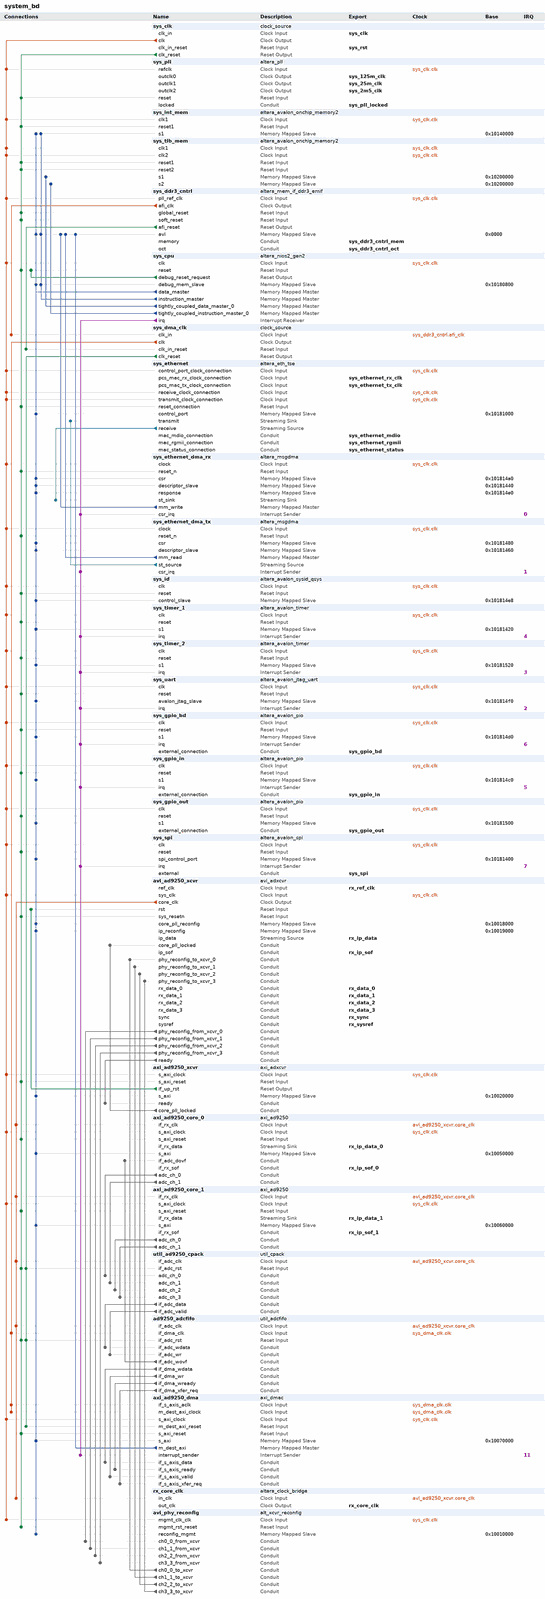
[diagram p0: system contents, whole]
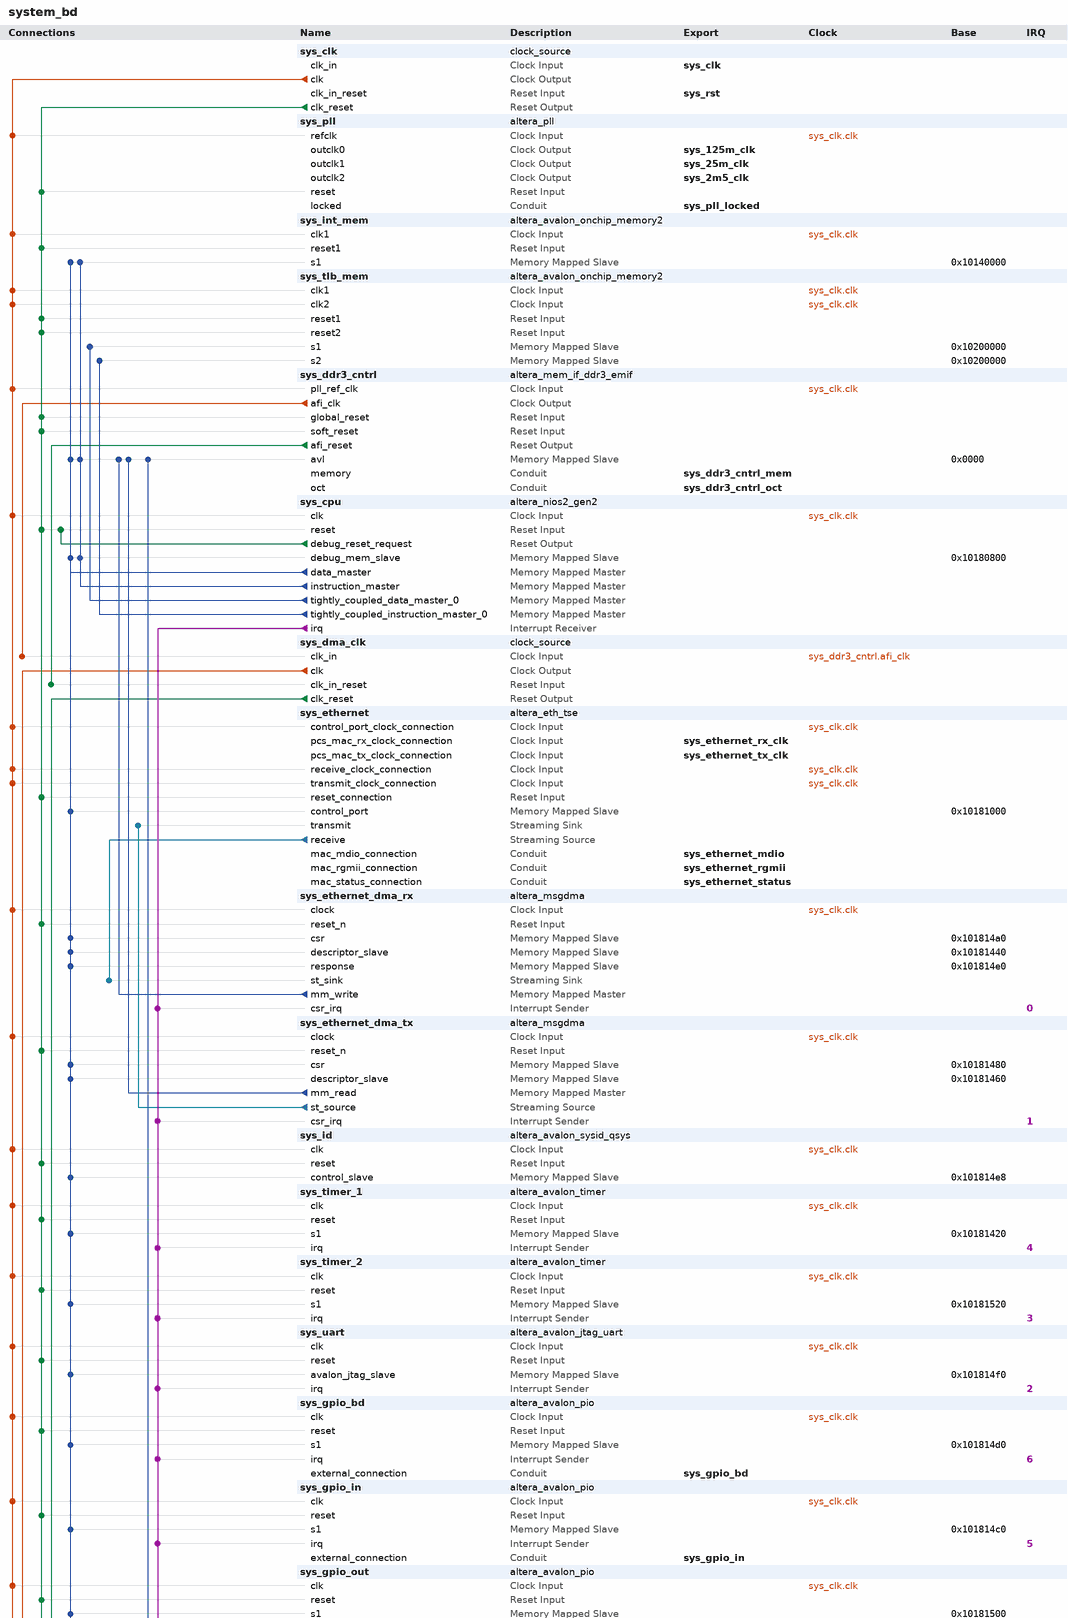
[diagram p1: system contents, upper part]
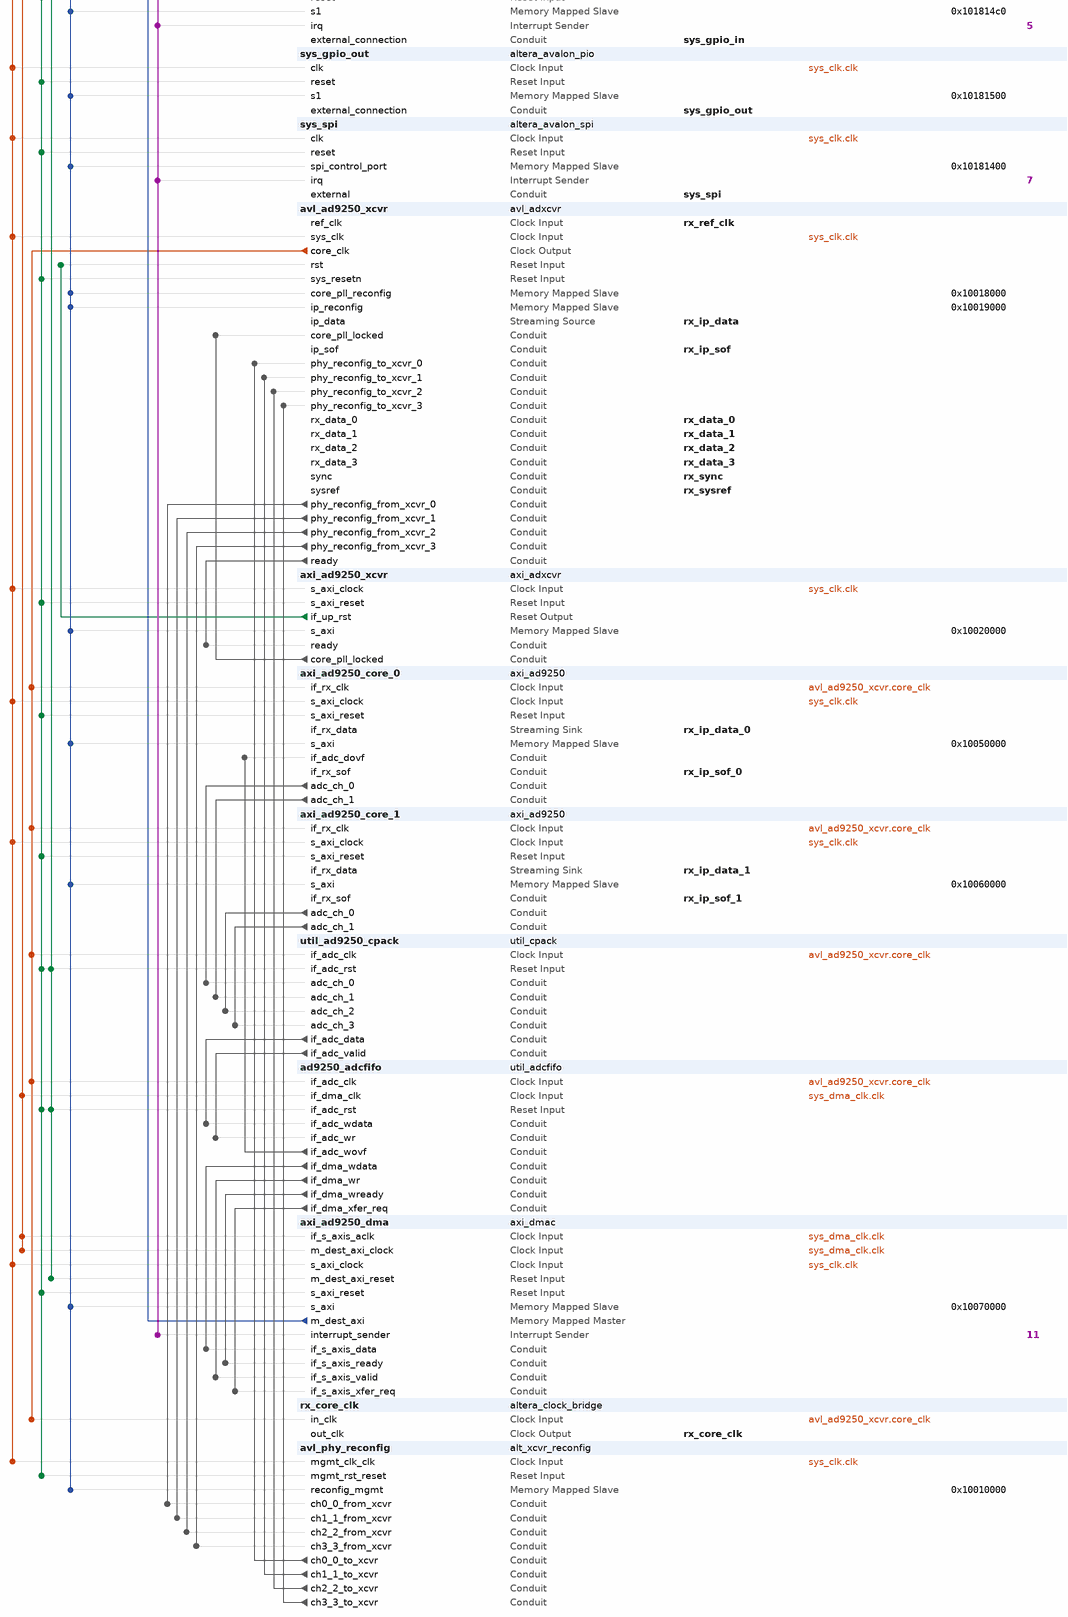
[diagram p2: system contents, lower part]
# Platform Designer (Qsys) system system_bd, Arria V 5AGTFD7K3F40I3
# Parameters at their usual value, and those the tool derives, are not listed.
package require -exact qsys 16.0
create_system system_bd
set_project_property DEVICE_FAMILY {Arria V}
set_project_property DEVICE 5AGTFD7K3F40I3

add_instance sys_clk clock_source 16.0
set_instance_parameter_value sys_clk clockFrequency 100000000
set_instance_parameter_value sys_clk resetSynchronousEdges DEASSERT

add_instance sys_pll altera_pll 16.0
set_instance_parameter_value sys_pll gui_device_speed_grade 1
set_instance_parameter_value sys_pll gui_number_of_clocks 3
set_instance_parameter_value sys_pll gui_operation_mode direct
set_instance_parameter_value sys_pll gui_output_clock_frequency0 125.0
set_instance_parameter_value sys_pll gui_output_clock_frequency1 25.0
set_instance_parameter_value sys_pll gui_output_clock_frequency2 2.5
set_instance_parameter_value sys_pll gui_pll_mode {Integer-N PLL}
set_instance_parameter_value sys_pll gui_reference_clock_frequency 100.0
set_instance_parameter_value sys_pll gui_use_locked true

add_instance sys_int_mem altera_avalon_onchip_memory2 16.0
set_instance_parameter_value sys_int_mem dataWidth 32
set_instance_parameter_value sys_int_mem dualPort false
set_instance_parameter_value sys_int_mem initMemContent false
set_instance_parameter_value sys_int_mem initializationFileName onchip_mem.hex
set_instance_parameter_value sys_int_mem memorySize 163840

add_instance sys_tlb_mem altera_avalon_onchip_memory2 16.0
set_instance_parameter_value sys_tlb_mem dataWidth 32
set_instance_parameter_value sys_tlb_mem dualPort true
set_instance_parameter_value sys_tlb_mem initMemContent true
set_instance_parameter_value sys_tlb_mem initializationFileName onchip_mem.hex
set_instance_parameter_value sys_tlb_mem memorySize 163840

add_instance sys_ddr3_cntrl altera_mem_if_ddr3_emif 16.0
set_instance_parameter_value sys_ddr3_cntrl AVL_MAX_SIZE 256
set_instance_parameter_value sys_ddr3_cntrl CALIBRATION_MODE Skip
set_instance_parameter_value sys_ddr3_cntrl CPORT_TYPE_PORT Bidirectional,Bidirectional,Bidirectional,Bidirectional,Bidirectional,Bidirectional
set_instance_parameter_value sys_ddr3_cntrl EXPORT_AFI_HALF_CLK false
set_instance_parameter_value sys_ddr3_cntrl HARD_EMIF false
set_instance_parameter_value sys_ddr3_cntrl MEM_BANKADDR_WIDTH 3
set_instance_parameter_value sys_ddr3_cntrl MEM_CLK_FREQ 400.0
set_instance_parameter_value sys_ddr3_cntrl MEM_CLK_FREQ_MAX 666.667
set_instance_parameter_value sys_ddr3_cntrl MEM_COL_ADDR_WIDTH 10
set_instance_parameter_value sys_ddr3_cntrl MEM_DQ_WIDTH 64
set_instance_parameter_value sys_ddr3_cntrl MEM_DRV_STR RZQ/6
set_instance_parameter_value sys_ddr3_cntrl MEM_FORMAT DISCRETE
set_instance_parameter_value sys_ddr3_cntrl MEM_ROW_ADDR_WIDTH 12
set_instance_parameter_value sys_ddr3_cntrl MEM_TCL 11
set_instance_parameter_value sys_ddr3_cntrl MEM_TFAW_NS 30.0
set_instance_parameter_value sys_ddr3_cntrl MEM_TRAS_NS 35.0
set_instance_parameter_value sys_ddr3_cntrl MEM_TRCD_NS 13.75
set_instance_parameter_value sys_ddr3_cntrl MEM_TRFC_NS 110.0
set_instance_parameter_value sys_ddr3_cntrl MEM_TRP_NS 13.75
set_instance_parameter_value sys_ddr3_cntrl MEM_TRRD_NS 6.0
set_instance_parameter_value sys_ddr3_cntrl MEM_TRTP_NS 7.5
set_instance_parameter_value sys_ddr3_cntrl MEM_TWTR 6
set_instance_parameter_value sys_ddr3_cntrl MEM_VENDOR Micron
set_instance_parameter_value sys_ddr3_cntrl MEM_WTCL 8
set_instance_parameter_value sys_ddr3_cntrl PLL_LOCATION Top_Bottom
set_instance_parameter_value sys_ddr3_cntrl POWER_OF_TWO_BUS false
set_instance_parameter_value sys_ddr3_cntrl PRIORITY_PORT 1,1,1,1,1,1
set_instance_parameter_value sys_ddr3_cntrl RATE Quarter
set_instance_parameter_value sys_ddr3_cntrl REF_CLK_FREQ 100.0
set_instance_parameter_value sys_ddr3_cntrl SPEED_GRADE 3
set_instance_parameter_value sys_ddr3_cntrl TIMING_BOARD_AC_SKEW 0.02
set_instance_parameter_value sys_ddr3_cntrl TIMING_BOARD_AC_TO_CK_SKEW 0.0
set_instance_parameter_value sys_ddr3_cntrl TIMING_BOARD_DQ_TO_DQS_SKEW 0.0
set_instance_parameter_value sys_ddr3_cntrl TIMING_BOARD_MAX_CK_DELAY 0.6
set_instance_parameter_value sys_ddr3_cntrl TIMING_BOARD_MAX_DQS_DELAY 0.6
set_instance_parameter_value sys_ddr3_cntrl TIMING_BOARD_SKEW_BETWEEN_DQS 0.02
set_instance_parameter_value sys_ddr3_cntrl TIMING_BOARD_SKEW_CKDQS_DIMM_MAX 0.01
set_instance_parameter_value sys_ddr3_cntrl TIMING_BOARD_SKEW_CKDQS_DIMM_MIN -0.01
set_instance_parameter_value sys_ddr3_cntrl TIMING_BOARD_SKEW_WITHIN_DQS 0.02
set_instance_parameter_value sys_ddr3_cntrl TIMING_TDH 45
set_instance_parameter_value sys_ddr3_cntrl TIMING_TDQSCK 255
set_instance_parameter_value sys_ddr3_cntrl TIMING_TDQSQ 100
set_instance_parameter_value sys_ddr3_cntrl TIMING_TDQSS 0.27
set_instance_parameter_value sys_ddr3_cntrl TIMING_TDS 10
set_instance_parameter_value sys_ddr3_cntrl TIMING_TDSH 0.18
set_instance_parameter_value sys_ddr3_cntrl TIMING_TDSS 0.18
set_instance_parameter_value sys_ddr3_cntrl TIMING_TIH 120
set_instance_parameter_value sys_ddr3_cntrl TIMING_TIS 170
set_instance_parameter_value sys_ddr3_cntrl TIMING_TQSH 0.4
set_instance_parameter_value sys_ddr3_cntrl USER_DEBUG_LEVEL 1

add_instance sys_cpu altera_nios2_gen2 16.0
set_instance_parameter_value sys_cpu dcache_numTCDM 1
set_instance_parameter_value sys_cpu dcache_size 32768
set_instance_parameter_value sys_cpu exceptionSlave sys_ddr3_cntrl.avl
set_instance_parameter_value sys_cpu icache_numTCIM 1
set_instance_parameter_value sys_cpu icache_size 32768
set_instance_parameter_value sys_cpu impl Fast
set_instance_parameter_value sys_cpu mmu_TLBMissExcOffset 4096
set_instance_parameter_value sys_cpu mmu_TLBMissExcSlave sys_tlb_mem.s2
set_instance_parameter_value sys_cpu mmu_autoAssignTlbPtrSz false
set_instance_parameter_value sys_cpu mmu_enabled true
set_instance_parameter_value sys_cpu mul_32_impl 3
set_instance_parameter_value sys_cpu resetSlave sys_ddr3_cntrl.avl
set_instance_parameter_value sys_cpu setting_activateTrace true
set_instance_parameter_value sys_cpu setting_support31bitdcachebypass false
set_instance_parameter_value sys_cpu shift_rot_impl 0

add_instance sys_dma_clk clock_source 16.0
set_instance_parameter_value sys_dma_clk clockFrequency 50000000

add_instance sys_ethernet altera_eth_tse 16.0
set_instance_parameter_value sys_ethernet core_variation MAC_ONLY
set_instance_parameter_value sys_ethernet enable_hd_logic true
set_instance_parameter_value sys_ethernet enable_mac_flow_ctrl true
set_instance_parameter_value sys_ethernet enable_magic_detect true
set_instance_parameter_value sys_ethernet enable_shift16 true
set_instance_parameter_value sys_ethernet ifGMII RGMII
set_instance_parameter_value sys_ethernet ing_addr 11
set_instance_parameter_value sys_ethernet mdio_clk_div 30
set_instance_parameter_value sys_ethernet stat_cnt_ena true
set_instance_parameter_value sys_ethernet transceiver_type NONE

add_instance sys_ethernet_dma_rx altera_msgdma 16.0
set_instance_parameter_value sys_ethernet_dma_rx BURST_ENABLE 1
set_instance_parameter_value sys_ethernet_dma_rx DATA_FIFO_DEPTH 256
set_instance_parameter_value sys_ethernet_dma_rx DATA_WIDTH 64
set_instance_parameter_value sys_ethernet_dma_rx DESCRIPTOR_FIFO_DEPTH 512
set_instance_parameter_value sys_ethernet_dma_rx ENHANCED_FEATURES 1
set_instance_parameter_value sys_ethernet_dma_rx ERROR_ENABLE 1
set_instance_parameter_value sys_ethernet_dma_rx ERROR_WIDTH 6
set_instance_parameter_value sys_ethernet_dma_rx MAX_BURST_COUNT 64
set_instance_parameter_value sys_ethernet_dma_rx MAX_BYTE 2048
set_instance_parameter_value sys_ethernet_dma_rx MODE 2
set_instance_parameter_value sys_ethernet_dma_rx PACKET_ENABLE 1
set_instance_parameter_value sys_ethernet_dma_rx RESPONSE_PORT 0
set_instance_parameter_value sys_ethernet_dma_rx TRANSFER_TYPE {Unaligned Accesses}

add_instance sys_ethernet_dma_tx altera_msgdma 16.0
set_instance_parameter_value sys_ethernet_dma_tx BURST_ENABLE 1
set_instance_parameter_value sys_ethernet_dma_tx DATA_FIFO_DEPTH 256
set_instance_parameter_value sys_ethernet_dma_tx DATA_WIDTH 64
set_instance_parameter_value sys_ethernet_dma_tx DESCRIPTOR_FIFO_DEPTH 512
set_instance_parameter_value sys_ethernet_dma_tx ENHANCED_FEATURES 1
set_instance_parameter_value sys_ethernet_dma_tx ERROR_ENABLE 1
set_instance_parameter_value sys_ethernet_dma_tx ERROR_WIDTH 1
set_instance_parameter_value sys_ethernet_dma_tx MAX_BURST_COUNT 64
set_instance_parameter_value sys_ethernet_dma_tx MAX_BYTE 2048
set_instance_parameter_value sys_ethernet_dma_tx MODE 1
set_instance_parameter_value sys_ethernet_dma_tx PACKET_ENABLE 1
set_instance_parameter_value sys_ethernet_dma_tx TRANSFER_TYPE {Unaligned Accesses}

add_instance sys_id altera_avalon_sysid_qsys 16.0
set_instance_parameter_value sys_id id 182193580

add_instance sys_timer_1 altera_avalon_timer 16.0
set_instance_parameter_value sys_timer_1 period 1
set_instance_parameter_value sys_timer_1 periodUnits MSEC

add_instance sys_timer_2 altera_avalon_timer 16.0
set_instance_parameter_value sys_timer_2 period 1
set_instance_parameter_value sys_timer_2 periodUnits MSEC

add_instance sys_uart altera_avalon_jtag_uart 16.0
set_instance_parameter_value sys_uart simInteractiveOptions NO_INTERACTIVE_WINDOWS

add_instance sys_gpio_bd altera_avalon_pio 16.0
set_instance_parameter_value sys_gpio_bd direction InOut
set_instance_parameter_value sys_gpio_bd generateIRQ true
set_instance_parameter_value sys_gpio_bd width 32

add_instance sys_gpio_in altera_avalon_pio 16.0
set_instance_parameter_value sys_gpio_in direction Input
set_instance_parameter_value sys_gpio_in generateIRQ true
set_instance_parameter_value sys_gpio_in width 32

add_instance sys_gpio_out altera_avalon_pio 16.0
set_instance_parameter_value sys_gpio_out direction Output
set_instance_parameter_value sys_gpio_out width 32

add_instance sys_spi altera_avalon_spi 16.0
set_instance_parameter_value sys_spi clockPolarity 0
set_instance_parameter_value sys_spi dataWidth 8
set_instance_parameter_value sys_spi masterSPI true
set_instance_parameter_value sys_spi numberOfSlaves 8
set_instance_parameter_value sys_spi targetClockRate 128000

add_instance avl_ad9250_xcvr avl_adxcvr 1.0
set_instance_parameter_value avl_ad9250_xcvr CORECLK_FREQUENCY 125.0
set_instance_parameter_value avl_ad9250_xcvr FRM_BCNT 4
set_instance_parameter_value avl_ad9250_xcvr FRM_SCNT 1
set_instance_parameter_value avl_ad9250_xcvr HD 0
set_instance_parameter_value avl_ad9250_xcvr ID 1
set_instance_parameter_value avl_ad9250_xcvr LANE_RATE 5000.0
set_instance_parameter_value avl_ad9250_xcvr MF_FCNT 32
set_instance_parameter_value avl_ad9250_xcvr NUM_OF_CONVS 4
set_instance_parameter_value avl_ad9250_xcvr NUM_OF_LANES 4
set_instance_parameter_value avl_ad9250_xcvr PCS_CONFIG JESD_PCS_CFG1
set_instance_parameter_value avl_ad9250_xcvr PLLCLK_FREQUENCY 2500.0
set_instance_parameter_value avl_ad9250_xcvr REFCLK_FREQUENCY 250.0
set_instance_parameter_value avl_ad9250_xcvr SYSCLK_FREQUENCY 100.0
set_instance_parameter_value avl_ad9250_xcvr TX_OR_RX_N 0

add_instance axi_ad9250_xcvr axi_adxcvr 1.0
set_instance_parameter_value axi_ad9250_xcvr ID 1
set_instance_parameter_value axi_ad9250_xcvr NUM_OF_LANES 4
set_instance_parameter_value axi_ad9250_xcvr TX_OR_RX_N 0

add_instance axi_ad9250_core_0 axi_ad9250 1.0
set_instance_parameter_value axi_ad9250_core_0 DEVICE_TYPE 1
set_instance_parameter_value axi_ad9250_core_0 ID 0

add_instance axi_ad9250_core_1 axi_ad9250 1.0
set_instance_parameter_value axi_ad9250_core_1 DEVICE_TYPE 1
set_instance_parameter_value axi_ad9250_core_1 ID 0

add_instance util_ad9250_cpack util_cpack 1.0
set_instance_parameter_value util_ad9250_cpack CHANNEL_DATA_WIDTH 32
set_instance_parameter_value util_ad9250_cpack NUM_OF_CHANNELS 4

add_instance ad9250_adcfifo util_adcfifo 1.0
set_instance_parameter_value ad9250_adcfifo ADC_DATA_WIDTH 128
set_instance_parameter_value ad9250_adcfifo DMA_ADDRESS_WIDTH 16
set_instance_parameter_value ad9250_adcfifo DMA_DATA_WIDTH 128
set_instance_parameter_value ad9250_adcfifo DMA_READY_ENABLE 1

add_instance axi_ad9250_dma axi_dmac 1.0
set_instance_parameter_value axi_ad9250_dma ASYNC_CLK_DEST_REQ 1
set_instance_parameter_value axi_ad9250_dma ASYNC_CLK_REQ_SRC 1
set_instance_parameter_value axi_ad9250_dma ASYNC_CLK_SRC_DEST 1
set_instance_parameter_value axi_ad9250_dma AXI_SLICE_DEST 0
set_instance_parameter_value axi_ad9250_dma AXI_SLICE_SRC 0
set_instance_parameter_value axi_ad9250_dma CYCLIC 0
set_instance_parameter_value axi_ad9250_dma DMA_2D_TRANSFER 0
set_instance_parameter_value axi_ad9250_dma DMA_DATA_WIDTH_DEST 128
set_instance_parameter_value axi_ad9250_dma DMA_DATA_WIDTH_SRC 128
set_instance_parameter_value axi_ad9250_dma DMA_LENGTH_WIDTH 24
set_instance_parameter_value axi_ad9250_dma DMA_TYPE_DEST 0
set_instance_parameter_value axi_ad9250_dma DMA_TYPE_SRC 1
set_instance_parameter_value axi_ad9250_dma FIFO_SIZE 4
set_instance_parameter_value axi_ad9250_dma ID 0
set_instance_parameter_value axi_ad9250_dma SYNC_TRANSFER_START 1

add_instance rx_core_clk altera_clock_bridge 16.0
set_instance_parameter_value rx_core_clk DERIVED_CLOCK_RATE 125
set_instance_parameter_value rx_core_clk EXPLICIT_CLOCK_RATE 0

add_instance avl_phy_reconfig alt_xcvr_reconfig 16.0
set_instance_parameter_value avl_phy_reconfig device_family {Arria V}
set_instance_parameter_value avl_phy_reconfig enable_adce 0
set_instance_parameter_value avl_phy_reconfig enable_analog 1
set_instance_parameter_value avl_phy_reconfig gui_split_sizes 1,1,1,1
set_instance_parameter_value avl_phy_reconfig number_of_reconfig_interfaces 4

# connections
add_connection avl_ad9250_xcvr.core_clk ad9250_adcfifo.if_adc_clk clock
add_connection avl_ad9250_xcvr.core_clk axi_ad9250_core_0.if_rx_clk clock
add_connection avl_ad9250_xcvr.core_clk axi_ad9250_core_1.if_rx_clk clock
add_connection avl_ad9250_xcvr.core_clk rx_core_clk.in_clk clock
add_connection avl_ad9250_xcvr.core_clk util_ad9250_cpack.if_adc_clk clock
add_connection sys_clk.clk avl_ad9250_xcvr.sys_clk clock
add_connection sys_clk.clk avl_phy_reconfig.mgmt_clk_clk clock
add_connection sys_clk.clk axi_ad9250_core_0.s_axi_clock clock
add_connection sys_clk.clk axi_ad9250_core_1.s_axi_clock clock
add_connection sys_clk.clk axi_ad9250_dma.s_axi_clock clock
add_connection sys_clk.clk axi_ad9250_xcvr.s_axi_clock clock
add_connection sys_clk.clk sys_cpu.clk clock
add_connection sys_clk.clk sys_ddr3_cntrl.pll_ref_clk clock
add_connection sys_clk.clk sys_ethernet.control_port_clock_connection clock
add_connection sys_clk.clk sys_ethernet.receive_clock_connection clock
add_connection sys_clk.clk sys_ethernet.transmit_clock_connection clock
add_connection sys_clk.clk sys_ethernet_dma_rx.clock clock
add_connection sys_clk.clk sys_ethernet_dma_tx.clock clock
add_connection sys_clk.clk sys_gpio_bd.clk clock
add_connection sys_clk.clk sys_gpio_in.clk clock
add_connection sys_clk.clk sys_gpio_out.clk clock
add_connection sys_clk.clk sys_id.clk clock
add_connection sys_clk.clk sys_int_mem.clk1 clock
add_connection sys_clk.clk sys_pll.refclk clock
add_connection sys_clk.clk sys_spi.clk clock
add_connection sys_clk.clk sys_timer_1.clk clock
add_connection sys_clk.clk sys_timer_2.clk clock
add_connection sys_clk.clk sys_tlb_mem.clk1 clock
add_connection sys_clk.clk sys_tlb_mem.clk2 clock
add_connection sys_clk.clk sys_uart.clk clock
add_connection sys_ddr3_cntrl.afi_clk sys_dma_clk.clk_in clock
add_connection sys_dma_clk.clk ad9250_adcfifo.if_dma_clk clock
add_connection sys_dma_clk.clk axi_ad9250_dma.if_s_axis_aclk clock
add_connection sys_dma_clk.clk axi_ad9250_dma.m_dest_axi_clock clock
add_connection axi_ad9250_xcvr.if_up_rst avl_ad9250_xcvr.rst reset
add_connection sys_clk.clk_reset ad9250_adcfifo.if_adc_rst reset
add_connection sys_clk.clk_reset avl_ad9250_xcvr.sys_resetn reset
add_connection sys_clk.clk_reset avl_phy_reconfig.mgmt_rst_reset reset
add_connection sys_clk.clk_reset axi_ad9250_core_0.s_axi_reset reset
add_connection sys_clk.clk_reset axi_ad9250_core_1.s_axi_reset reset
add_connection sys_clk.clk_reset axi_ad9250_dma.s_axi_reset reset
add_connection sys_clk.clk_reset axi_ad9250_xcvr.s_axi_reset reset
add_connection sys_clk.clk_reset sys_cpu.reset reset
add_connection sys_clk.clk_reset sys_ddr3_cntrl.global_reset reset
add_connection sys_clk.clk_reset sys_ddr3_cntrl.soft_reset reset
add_connection sys_clk.clk_reset sys_ethernet.reset_connection reset
add_connection sys_clk.clk_reset sys_ethernet_dma_rx.reset_n reset
add_connection sys_clk.clk_reset sys_ethernet_dma_tx.reset_n reset
add_connection sys_clk.clk_reset sys_gpio_bd.reset reset
add_connection sys_clk.clk_reset sys_gpio_in.reset reset
add_connection sys_clk.clk_reset sys_gpio_out.reset reset
add_connection sys_clk.clk_reset sys_id.reset reset
add_connection sys_clk.clk_reset sys_int_mem.reset1 reset
add_connection sys_clk.clk_reset sys_pll.reset reset
add_connection sys_clk.clk_reset sys_spi.reset reset
add_connection sys_clk.clk_reset sys_timer_1.reset reset
add_connection sys_clk.clk_reset sys_timer_2.reset reset
add_connection sys_clk.clk_reset sys_tlb_mem.reset1 reset
add_connection sys_clk.clk_reset sys_tlb_mem.reset2 reset
add_connection sys_clk.clk_reset sys_uart.reset reset
add_connection sys_clk.clk_reset util_ad9250_cpack.if_adc_rst reset
add_connection sys_cpu.debug_reset_request sys_cpu.reset reset
add_connection sys_ddr3_cntrl.afi_reset sys_dma_clk.clk_in_reset reset
add_connection sys_dma_clk.clk_reset ad9250_adcfifo.if_adc_rst reset
add_connection sys_dma_clk.clk_reset axi_ad9250_dma.m_dest_axi_reset reset
add_connection sys_dma_clk.clk_reset util_ad9250_cpack.if_adc_rst reset
add_connection axi_ad9250_dma.m_dest_axi sys_ddr3_cntrl.avl avalon
set_connection_parameter_value axi_ad9250_dma.m_dest_axi/sys_ddr3_cntrl.avl baseAddress 0x0000
add_connection sys_cpu.data_master avl_ad9250_xcvr.core_pll_reconfig avalon
set_connection_parameter_value sys_cpu.data_master/avl_ad9250_xcvr.core_pll_reconfig baseAddress 0x10018000
add_connection sys_cpu.data_master avl_ad9250_xcvr.ip_reconfig avalon
set_connection_parameter_value sys_cpu.data_master/avl_ad9250_xcvr.ip_reconfig baseAddress 0x10019000
add_connection sys_cpu.data_master avl_phy_reconfig.reconfig_mgmt avalon
set_connection_parameter_value sys_cpu.data_master/avl_phy_reconfig.reconfig_mgmt baseAddress 0x10010000
add_connection sys_cpu.data_master axi_ad9250_core_0.s_axi avalon
set_connection_parameter_value sys_cpu.data_master/axi_ad9250_core_0.s_axi baseAddress 0x10050000
add_connection sys_cpu.data_master axi_ad9250_core_1.s_axi avalon
set_connection_parameter_value sys_cpu.data_master/axi_ad9250_core_1.s_axi baseAddress 0x10060000
add_connection sys_cpu.data_master axi_ad9250_dma.s_axi avalon
set_connection_parameter_value sys_cpu.data_master/axi_ad9250_dma.s_axi baseAddress 0x10070000
add_connection sys_cpu.data_master axi_ad9250_xcvr.s_axi avalon
set_connection_parameter_value sys_cpu.data_master/axi_ad9250_xcvr.s_axi baseAddress 0x10020000
add_connection sys_cpu.data_master sys_cpu.debug_mem_slave avalon
set_connection_parameter_value sys_cpu.data_master/sys_cpu.debug_mem_slave baseAddress 0x10180800
add_connection sys_cpu.data_master sys_ddr3_cntrl.avl avalon
set_connection_parameter_value sys_cpu.data_master/sys_ddr3_cntrl.avl baseAddress 0x0000
add_connection sys_cpu.data_master sys_ethernet.control_port avalon
set_connection_parameter_value sys_cpu.data_master/sys_ethernet.control_port baseAddress 0x10181000
add_connection sys_cpu.data_master sys_ethernet_dma_rx.csr avalon
set_connection_parameter_value sys_cpu.data_master/sys_ethernet_dma_rx.csr baseAddress 0x101814a0
add_connection sys_cpu.data_master sys_ethernet_dma_rx.descriptor_slave avalon
set_connection_parameter_value sys_cpu.data_master/sys_ethernet_dma_rx.descriptor_slave baseAddress 0x10181440
add_connection sys_cpu.data_master sys_ethernet_dma_rx.response avalon
set_connection_parameter_value sys_cpu.data_master/sys_ethernet_dma_rx.response baseAddress 0x101814e0
add_connection sys_cpu.data_master sys_ethernet_dma_tx.csr avalon
set_connection_parameter_value sys_cpu.data_master/sys_ethernet_dma_tx.csr baseAddress 0x10181480
add_connection sys_cpu.data_master sys_ethernet_dma_tx.descriptor_slave avalon
set_connection_parameter_value sys_cpu.data_master/sys_ethernet_dma_tx.descriptor_slave baseAddress 0x10181460
add_connection sys_cpu.data_master sys_gpio_bd.s1 avalon
set_connection_parameter_value sys_cpu.data_master/sys_gpio_bd.s1 baseAddress 0x101814d0
add_connection sys_cpu.data_master sys_gpio_in.s1 avalon
set_connection_parameter_value sys_cpu.data_master/sys_gpio_in.s1 baseAddress 0x101814c0
add_connection sys_cpu.data_master sys_gpio_out.s1 avalon
set_connection_parameter_value sys_cpu.data_master/sys_gpio_out.s1 baseAddress 0x10181500
add_connection sys_cpu.data_master sys_id.control_slave avalon
set_connection_parameter_value sys_cpu.data_master/sys_id.control_slave baseAddress 0x101814e8
add_connection sys_cpu.data_master sys_int_mem.s1 avalon
set_connection_parameter_value sys_cpu.data_master/sys_int_mem.s1 baseAddress 0x10140000
add_connection sys_cpu.data_master sys_spi.spi_control_port avalon
set_connection_parameter_value sys_cpu.data_master/sys_spi.spi_control_port baseAddress 0x10181400
add_connection sys_cpu.data_master sys_timer_1.s1 avalon
set_connection_parameter_value sys_cpu.data_master/sys_timer_1.s1 baseAddress 0x10181420
add_connection sys_cpu.data_master sys_timer_2.s1 avalon
set_connection_parameter_value sys_cpu.data_master/sys_timer_2.s1 baseAddress 0x10181520
add_connection sys_cpu.data_master sys_uart.avalon_jtag_slave avalon
set_connection_parameter_value sys_cpu.data_master/sys_uart.avalon_jtag_slave baseAddress 0x101814f0
add_connection sys_cpu.instruction_master sys_cpu.debug_mem_slave avalon
set_connection_parameter_value sys_cpu.instruction_master/sys_cpu.debug_mem_slave baseAddress 0x10180800
add_connection sys_cpu.instruction_master sys_ddr3_cntrl.avl avalon
set_connection_parameter_value sys_cpu.instruction_master/sys_ddr3_cntrl.avl baseAddress 0x0000
add_connection sys_cpu.instruction_master sys_int_mem.s1 avalon
set_connection_parameter_value sys_cpu.instruction_master/sys_int_mem.s1 baseAddress 0x10140000
add_connection sys_cpu.tightly_coupled_data_master_0 sys_tlb_mem.s1 avalon
set_connection_parameter_value sys_cpu.tightly_coupled_data_master_0/sys_tlb_mem.s1 baseAddress 0x10200000
add_connection sys_cpu.tightly_coupled_instruction_master_0 sys_tlb_mem.s2 avalon
set_connection_parameter_value sys_cpu.tightly_coupled_instruction_master_0/sys_tlb_mem.s2 baseAddress 0x10200000
add_connection sys_ethernet_dma_rx.mm_write sys_ddr3_cntrl.avl avalon
set_connection_parameter_value sys_ethernet_dma_rx.mm_write/sys_ddr3_cntrl.avl baseAddress 0x0000
add_connection sys_ethernet_dma_tx.mm_read sys_ddr3_cntrl.avl avalon
set_connection_parameter_value sys_ethernet_dma_tx.mm_read/sys_ddr3_cntrl.avl baseAddress 0x0000
add_connection sys_ethernet.receive sys_ethernet_dma_rx.st_sink avalon_streaming
add_connection sys_ethernet_dma_tx.st_source sys_ethernet.transmit avalon_streaming
add_connection ad9250_adcfifo.if_adc_wovf axi_ad9250_core_0.if_adc_dovf conduit
add_connection ad9250_adcfifo.if_dma_wdata axi_ad9250_dma.if_s_axis_data conduit
add_connection ad9250_adcfifo.if_dma_wr axi_ad9250_dma.if_s_axis_valid conduit
add_connection ad9250_adcfifo.if_dma_wready axi_ad9250_dma.if_s_axis_ready conduit
add_connection ad9250_adcfifo.if_dma_xfer_req axi_ad9250_dma.if_s_axis_xfer_req conduit
add_connection avl_ad9250_xcvr.phy_reconfig_from_xcvr_0 avl_phy_reconfig.ch0_0_from_xcvr conduit
add_connection avl_ad9250_xcvr.phy_reconfig_from_xcvr_1 avl_phy_reconfig.ch1_1_from_xcvr conduit
add_connection avl_ad9250_xcvr.phy_reconfig_from_xcvr_2 avl_phy_reconfig.ch2_2_from_xcvr conduit
add_connection avl_ad9250_xcvr.phy_reconfig_from_xcvr_3 avl_phy_reconfig.ch3_3_from_xcvr conduit
add_connection avl_ad9250_xcvr.ready axi_ad9250_xcvr.ready conduit
add_connection avl_phy_reconfig.ch0_0_to_xcvr avl_ad9250_xcvr.phy_reconfig_to_xcvr_0 conduit
add_connection avl_phy_reconfig.ch1_1_to_xcvr avl_ad9250_xcvr.phy_reconfig_to_xcvr_1 conduit
add_connection avl_phy_reconfig.ch2_2_to_xcvr avl_ad9250_xcvr.phy_reconfig_to_xcvr_2 conduit
add_connection avl_phy_reconfig.ch3_3_to_xcvr avl_ad9250_xcvr.phy_reconfig_to_xcvr_3 conduit
add_connection axi_ad9250_core_0.adc_ch_0 util_ad9250_cpack.adc_ch_0 conduit
add_connection axi_ad9250_core_0.adc_ch_1 util_ad9250_cpack.adc_ch_1 conduit
add_connection axi_ad9250_core_1.adc_ch_0 util_ad9250_cpack.adc_ch_2 conduit
add_connection axi_ad9250_core_1.adc_ch_1 util_ad9250_cpack.adc_ch_3 conduit
add_connection axi_ad9250_xcvr.core_pll_locked avl_ad9250_xcvr.core_pll_locked conduit
add_connection util_ad9250_cpack.if_adc_data ad9250_adcfifo.if_adc_wdata conduit
add_connection util_ad9250_cpack.if_adc_valid ad9250_adcfifo.if_adc_wr conduit
add_connection sys_cpu.irq axi_ad9250_dma.interrupt_sender interrupt
set_connection_parameter_value sys_cpu.irq/axi_ad9250_dma.interrupt_sender irqNumber 11
add_connection sys_cpu.irq sys_ethernet_dma_rx.csr_irq interrupt
set_connection_parameter_value sys_cpu.irq/sys_ethernet_dma_rx.csr_irq irqNumber 0
add_connection sys_cpu.irq sys_ethernet_dma_tx.csr_irq interrupt
set_connection_parameter_value sys_cpu.irq/sys_ethernet_dma_tx.csr_irq irqNumber 1
add_connection sys_cpu.irq sys_gpio_bd.irq interrupt
set_connection_parameter_value sys_cpu.irq/sys_gpio_bd.irq irqNumber 6
add_connection sys_cpu.irq sys_gpio_in.irq interrupt
set_connection_parameter_value sys_cpu.irq/sys_gpio_in.irq irqNumber 5
add_connection sys_cpu.irq sys_spi.irq interrupt
set_connection_parameter_value sys_cpu.irq/sys_spi.irq irqNumber 7
add_connection sys_cpu.irq sys_timer_1.irq interrupt
set_connection_parameter_value sys_cpu.irq/sys_timer_1.irq irqNumber 4
add_connection sys_cpu.irq sys_timer_2.irq interrupt
set_connection_parameter_value sys_cpu.irq/sys_timer_2.irq irqNumber 3
add_connection sys_cpu.irq sys_uart.irq interrupt
set_connection_parameter_value sys_cpu.irq/sys_uart.irq irqNumber 2

# exported interfaces
add_interface rx_core_clk clock source
set_interface_property rx_core_clk EXPORT_OF rx_core_clk.out_clk
add_interface rx_data_0 conduit end
set_interface_property rx_data_0 EXPORT_OF avl_ad9250_xcvr.rx_data_0
add_interface rx_data_1 conduit end
set_interface_property rx_data_1 EXPORT_OF avl_ad9250_xcvr.rx_data_1
add_interface rx_data_2 conduit end
set_interface_property rx_data_2 EXPORT_OF avl_ad9250_xcvr.rx_data_2
add_interface rx_data_3 conduit end
set_interface_property rx_data_3 EXPORT_OF avl_ad9250_xcvr.rx_data_3
add_interface rx_ip_data avalon_streaming source
set_interface_property rx_ip_data EXPORT_OF avl_ad9250_xcvr.ip_data
add_interface rx_ip_data_0 avalon_streaming sink
set_interface_property rx_ip_data_0 EXPORT_OF axi_ad9250_core_0.if_rx_data
add_interface rx_ip_data_1 avalon_streaming sink
set_interface_property rx_ip_data_1 EXPORT_OF axi_ad9250_core_1.if_rx_data
add_interface rx_ip_sof conduit end
set_interface_property rx_ip_sof EXPORT_OF avl_ad9250_xcvr.ip_sof
add_interface rx_ip_sof_0 conduit end
set_interface_property rx_ip_sof_0 EXPORT_OF axi_ad9250_core_0.if_rx_sof
add_interface rx_ip_sof_1 conduit end
set_interface_property rx_ip_sof_1 EXPORT_OF axi_ad9250_core_1.if_rx_sof
add_interface rx_ref_clk clock sink
set_interface_property rx_ref_clk EXPORT_OF avl_ad9250_xcvr.ref_clk
add_interface rx_sync conduit end
set_interface_property rx_sync EXPORT_OF avl_ad9250_xcvr.sync
add_interface rx_sysref conduit end
set_interface_property rx_sysref EXPORT_OF avl_ad9250_xcvr.sysref
add_interface sys_125m_clk clock source
set_interface_property sys_125m_clk EXPORT_OF sys_pll.outclk0
add_interface sys_25m_clk clock source
set_interface_property sys_25m_clk EXPORT_OF sys_pll.outclk1
add_interface sys_2m5_clk clock source
set_interface_property sys_2m5_clk EXPORT_OF sys_pll.outclk2
add_interface sys_clk clock sink
set_interface_property sys_clk EXPORT_OF sys_clk.clk_in
add_interface sys_ddr3_cntrl_mem conduit end
set_interface_property sys_ddr3_cntrl_mem EXPORT_OF sys_ddr3_cntrl.memory
add_interface sys_ddr3_cntrl_oct conduit end
set_interface_property sys_ddr3_cntrl_oct EXPORT_OF sys_ddr3_cntrl.oct
add_interface sys_ethernet_mdio conduit end
set_interface_property sys_ethernet_mdio EXPORT_OF sys_ethernet.mac_mdio_connection
add_interface sys_ethernet_rgmii conduit end
set_interface_property sys_ethernet_rgmii EXPORT_OF sys_ethernet.mac_rgmii_connection
add_interface sys_ethernet_rx_clk clock sink
set_interface_property sys_ethernet_rx_clk EXPORT_OF sys_ethernet.pcs_mac_rx_clock_connection
add_interface sys_ethernet_status conduit end
set_interface_property sys_ethernet_status EXPORT_OF sys_ethernet.mac_status_connection
add_interface sys_ethernet_tx_clk clock sink
set_interface_property sys_ethernet_tx_clk EXPORT_OF sys_ethernet.pcs_mac_tx_clock_connection
add_interface sys_gpio_bd conduit end
set_interface_property sys_gpio_bd EXPORT_OF sys_gpio_bd.external_connection
add_interface sys_gpio_in conduit end
set_interface_property sys_gpio_in EXPORT_OF sys_gpio_in.external_connection
add_interface sys_gpio_out conduit end
set_interface_property sys_gpio_out EXPORT_OF sys_gpio_out.external_connection
add_interface sys_pll_locked conduit end
set_interface_property sys_pll_locked EXPORT_OF sys_pll.locked
add_interface sys_rst reset sink
set_interface_property sys_rst EXPORT_OF sys_clk.clk_in_reset
add_interface sys_spi conduit end
set_interface_property sys_spi EXPORT_OF sys_spi.external

set_interconnect_requirement {$system} qsys_mm.clockCrossingAdapter HANDSHAKE
set_interconnect_requirement {$system} qsys_mm.maxAdditionalLatency 0

save_system system_bd.qsys
